# EAGLE schematic hbridge_ustx (EAGLE 6.3)
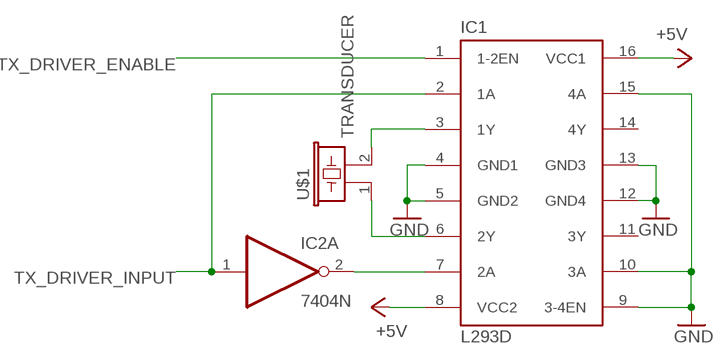
[diagram p0: schematic, sheet 1]

## Parts
IC1  L293D  [DIL16]
IC2  7404N  [DIL14]
U$1  TRANSDUCER  [TRANSDUCER]

## Nets
+5V: IC1.8(VCC2) IC1.16(VCC1)
GND: IC1.4(GND1) IC1.5(GND2) IC1.9(3-4EN) IC1.10(3A) IC1.12(GND4) IC1.13(GND3) IC1.15(4A)
N$1: IC1.3(1Y) U$1.2
N$2: IC1.6(2Y) U$1.1
N$4: IC1.7(2A) IC2.2(A:O)
TX_DRIVER_ENABLE: IC1.1(1-2EN)
TX_DRIVER_INPUT: IC1.2(1A) IC2.1(A:I)
Unconnected: IC1.11(3Y) IC1.14(4Y) IC2.3(B:I) IC2.4(B:O) IC2.5(C:I) IC2.6(C:O) IC2.8(D:O) IC2.9(D:I) IC2.10(E:O) IC2.11(E:I) IC2.12(F:O) IC2.13(F:I)

## Power pins joined to a net without a drawn wire
GND: IC2.7(P:GND)
VCC: IC2.14(P:VCC)

## Library data of the parts
IC1 = st-microelectronics:L293D: PUSH-PULL 4 CHANNEL DRIVER; MPN: L293D; OC_FARNELL: 9589619; OC_NEWARK: 56P8249
IC2 = 74xx-eu:74*04: Hex INVERTER
U$1 = Ultrasound:TRANSDUCER